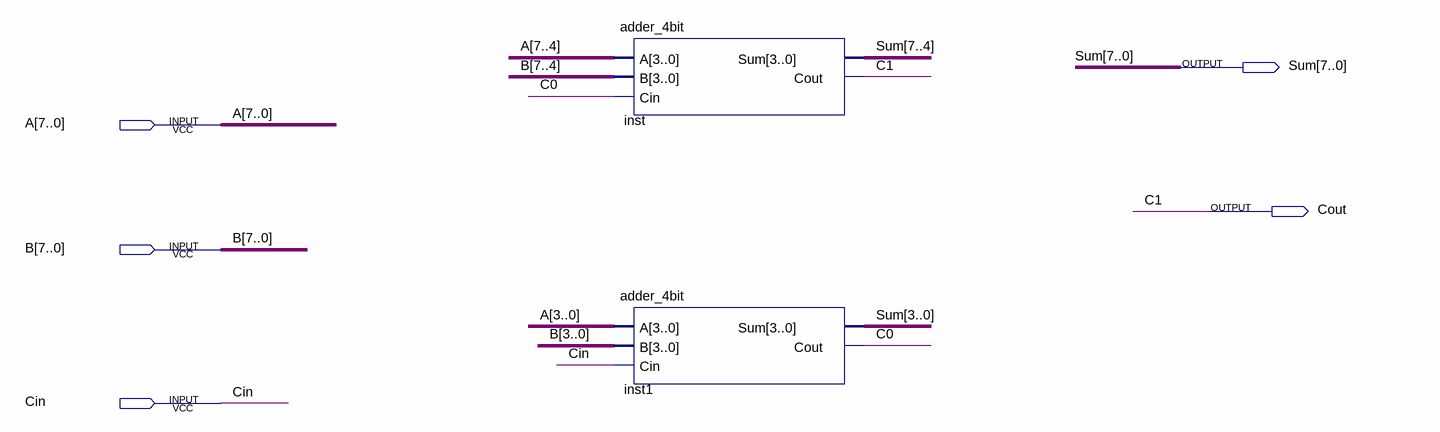
[diagram p0: schematic sheet]
// Quartus schematic adder_8bit.bdf as structural Verilog: 2 symbols, 5 pins
module adder_8bit (
  input  [7:0] A,
  input  [7:0] B,
  input  Cin,
  output [7:0] Sum,
  output Cout
);

  wire C0;

  adder_4bit inst (.A(A[7:4]), .B(B[7:4]), .Cin(C0), .Sum(Sum[7:4]), .Cout(Cout));
  adder_4bit inst1 (.A(A[3:0]), .B(B[3:0]), .Cin(Cin), .Sum(Sum[3:0]), .Cout(C0));

  // Other names for the same wires on the sheet: C1 = Cout
endmodule
